# Altium schematic sheet PARA HACER BODE Y PRUEBAS de EA.SCHDOC
size 508 x 241 mm
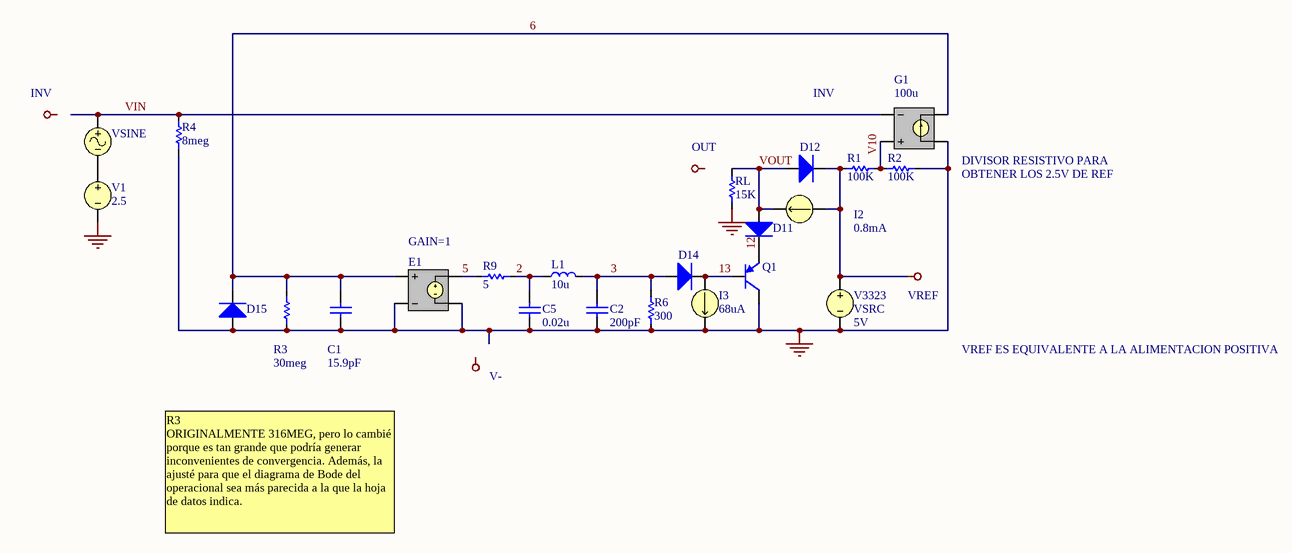
[diagram p0: PARA HACER BODE Y PRUEBAS de EA.SCHDOC]

## Parts
C1  value 15.9pF  [0805]  (hidden comment: Cap)
C2  value 200pF  [0805]  (hidden comment: Cap)
C5  value 0.02u  [0805]  (hidden comment: Cap)
D11  Diode  [diode400]  (value not drawn)
D12  Diode  [diode400]  (value not drawn)
D14  Diode  [diode400]  (value not drawn)
D15  Diode  [diode400]  (value not drawn)
E1  ESRC  (value not drawn)
G1  Gain: 100u  (hidden comment: GSRC)
I2  value 0.8mA  (hidden comment: ISRC)
I3  value 68uA  (hidden comment: ISRC)
L1  value 10u  [TOROIDE TN14-9-5]  (hidden comment: Inductor2)
Q1  PNP  [SOT23]  (value not drawn)
R1  value 100K  [0805]  (hidden comment: Res)
R2  value 100K  [0805]  (hidden comment: Res)
R3  value 30meg  [0805]  (hidden comment: Res)
R4  value 8meg  [0805]  (hidden comment: Res)
R6  value 300  [0805]  (hidden comment: Res)
R9  value 5  [0805]  (hidden comment: Res)
RL  value 15K  [0805]  (hidden comment: Res)
V1  value 2.5  (hidden comment: VSRC)
V3323  VSRC  value 5V
VSINE  VSIN  (value not drawn)

## Nets
4: D12.2 I2.1 R1.2 V3323.1
GND: C1.1 C2.1 C5.1 D15.1 E1.2(NC-) E1.4(N-) G1.3(N+) I3.2 Q1.1(C) R2.2 R3.1 R4.1 R6.1 RL.1 V1.2 V3323.2
2: C5.2 L1.1 R9.1
3: C2.2 D14.1 L1.2 R6.2
5: E1.3(N+) R9.2
6: C1.2 D15.2 E1.1(NC+) G1.4(N-) R3.2
12: D11.2 Q1.3(E)
13: D14.2 I3.1 Q1.2(B)
V10: G1.1(NC+) R1.1 R2.1
VIN: G1.2(NC-) R4.2 VSINE.1
VOUT: D11.1 D12.1 I2.2 RL.2
NetV1_1: V1.1 VSINE.2

## Notes on the sheet
- INV
- (near RL) OUT
- DIVISOR RESISTIVO PARA
- OBTENER LOS 2.5V DE REF
- (near E1) GAIN=1
- VREF
- VREF ES EQUIVALENTE A LA ALIMENTACION POSITIVA
- V-
- R3
  ORIGINALMENTE 316MEG, pero lo cambié porque es tan grande que podría generar inconvenientes de convergencia. Además, la ajusté para que el diagrama de Bode del operacional sea más parecida a la que la hoja de datos indica.
- Labels drawn without touching a wire or pin: 1, 9, 20

## Library data of the parts
C1 C2 C5 = Cap: Capacitor; Voltage: 50V; Price: 0.25; Technology: Ceramic
D11 D12 D14 D15 = Diode: Diodo; Price: ?
E1 = ESRC: Voltage Controlled Voltage Source; Note: PCB Footprint - Not required; Published: 8-Jun-2000; Revision: 17-Jul-2002: Re-released for DXP Platform.; Package Reference: Not Applicable; Publisher: Altium Limited
G1 = GSRC: Voltage Controlled Current Source; Note: PCB Footprint - Not required; Published: 8-Jun-2000; Revision: 17-Jul-2002: Re-released for DXP Platform.; Package Reference: Not Applicable; Publisher: Altium Limited
I2 I3 = ISRC: Current Source; Note: PCB Footprint - Not required; Published: 8-Jun-2000; Revision: 17-Jul-2002: Re-released for DXP Platform.; Package Reference: Not Applicable; Publisher: Altium Limited
L1 = Inductor2: Inductor; Revision: July-2002: Re-released for DXP Platform.
Q1 = PNP: PNP Bipolar Transistor; pin to pad: 1>3 2>1 3>2; Price: 0.3267
R1-R4 R6 R9 RL = Res: Resistor; Power: 0.25W; Price: 0.036
V1 V3323 = VSRC: Voltage Source; Note: PCB Footprint - Not required; Published: 8-Jun-2000; Revision: 17-Jul-2002: Re-released for DXP Platform.; Package Reference: Not Applicable; Publisher: Altium Limited
VSINE = VSIN: Sinusoidal Voltage Source; Revision 1: 15-Jun-2001: Default value added for damping factor (F8:0).; Revision 2: 17-July-2002: Re-released for DXP Platform.; Note: PCB Footprint - Not required; Published: 8-Jun-2000; Package Reference: Not Applicable; Publisher: Altium Limited